# Altium project DAQ_REV_B.PrjPcb
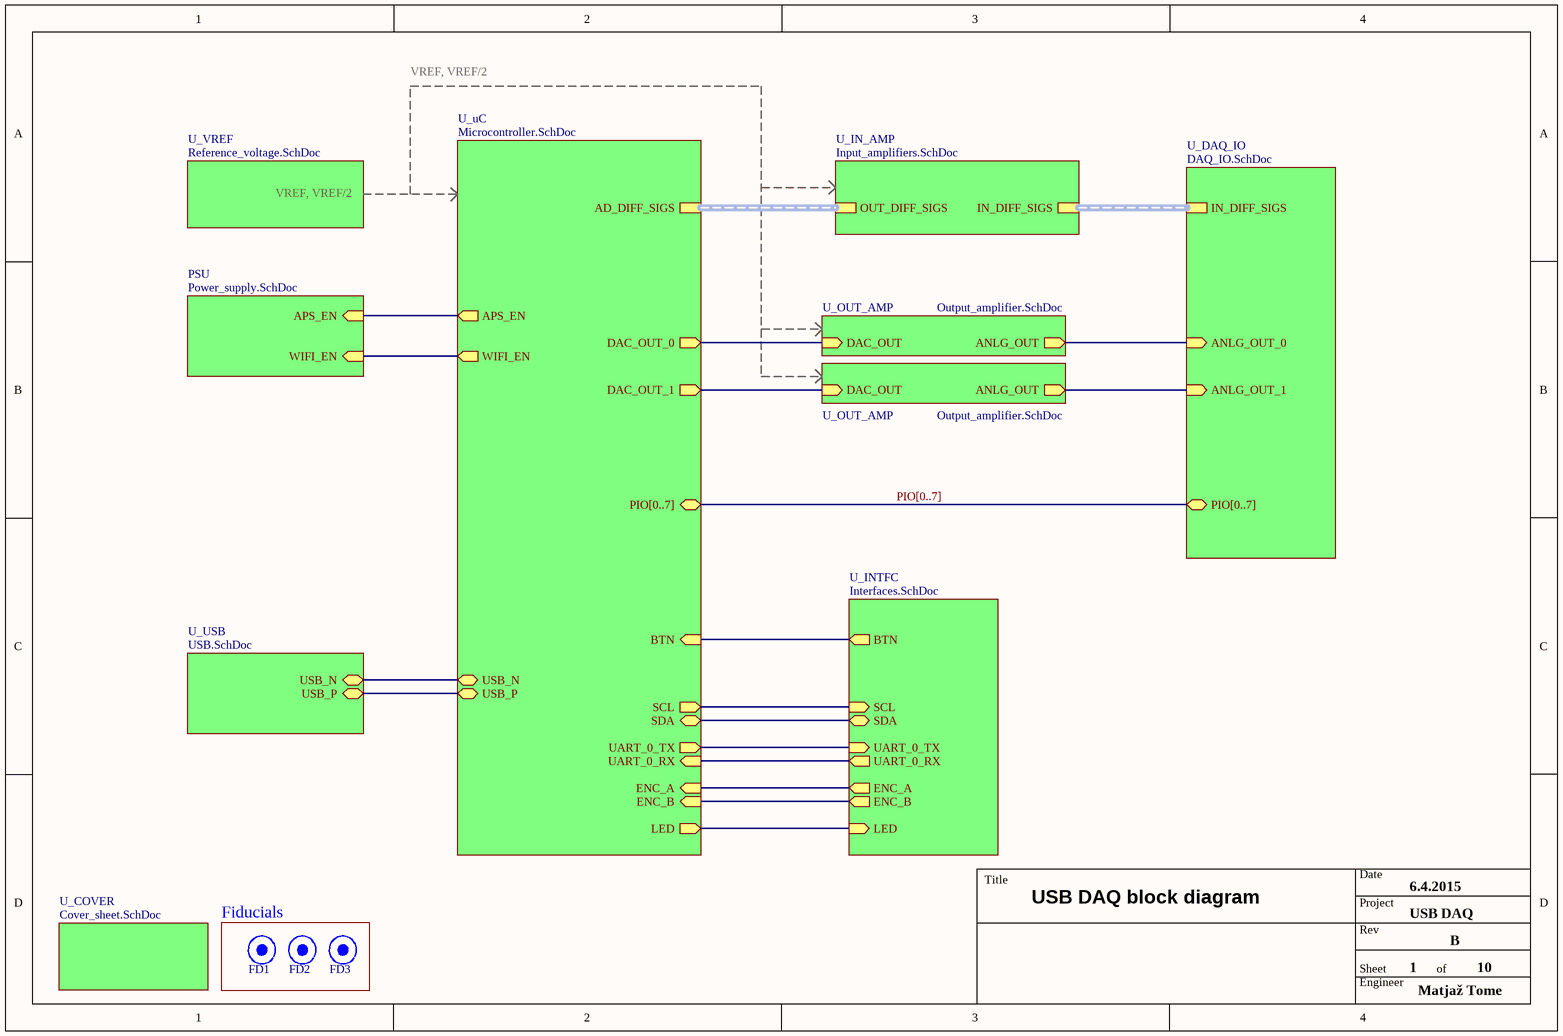
[diagram p0: DAQ_REV_B.SchDoc]
7 sheets, 113 parts. Net scope: hierarchical (ports join the sheet entries above them; power ports are global).
Board file: USB_DAQ.PcbDoc
Sheets:
  DAQ_REV_B.SchDoc
    U_uC = Microcontroller.SchDoc
    U_DAQ_IO = DAQ_IO.SchDoc
    U_INTFC = Interfaces.SchDoc
    U_IN_AMP = Input_amplifiers.SchDoc
    U_OUT_AMP = Output_amplifier.SchDoc
    U_VREF = Reference_voltage.SchDoc
    U_OUT_AMP = Output_amplifier.SchDoc

## Sheet DAQ_REV_B.SchDoc: USB DAQ block diagram
size A4; Date: 6.4.2015; Engineer: Matjaž Tome; DocumentNumber: 1; Revision: B; SheetNumber: 1; SheetTotal: 10; Project: USB DAQ

### Parts
FD1  Fiducial 1mm  [FID1]  (value not drawn)  (no BOM)
FD2  Fiducial 1mm  [FID1]  (value not drawn)  (no BOM)
FD3  Fiducial 1mm  [FID1]  (value not drawn)  (no BOM)

### Blocks framed on the sheet
Fiducials: FD1-FD3

### Sub-sheets
PSU = Power_supply.SchDoc (file not in this document): WIFI_EN (in), APS_EN (in)
U_COVER = Cover_sheet.SchDoc (file not in this document): no entries
U_DAQ_IO = DAQ_IO.SchDoc: ANLG_OUT_0 (in), ANLG_OUT_1 (in), IN_DIFF_SIGS (harness DIFF_SIGNALS), PIO[0..7] (bidir)
U_IN_AMP = Input_amplifiers.SchDoc: IN_DIFF_SIGS (harness DIFF_SIGNALS), OUT_DIFF_SIGS (harness DIFF_SIGNALS)
U_INTFC = Interfaces.SchDoc: BTN (out), SCL (in), SDA (bidir), UART_0_TX (in), UART_0_RX (out), ENC_A (out), ENC_B (out), LED (in)
U_OUT_AMP = Output_amplifier.SchDoc: ANLG_OUT (out), DAC_OUT (in)
U_OUT_AMP = Output_amplifier.SchDoc: ANLG_OUT (out), DAC_OUT (in)
U_uC = Microcontroller.SchDoc: USB_N (bidir), USB_P (bidir), DAC_OUT_0 (out), DAC_OUT_1 (out), APS_EN (out), UART_0_TX (out), UART_0_RX (in), SCL (out), SDA (bidir), ENC_A (in), ENC_B (in), WIFI_EN (out), BTN (in), LED (out), AD_DIFF_SIGS (harness DIFF_SIGNALS), PIO[0..7] (bidir)
U_USB = USB.SchDoc (file not in this document): USB_N (bidir), USB_P (bidir)
U_VREF = Reference_voltage.SchDoc: no entries

### Nets
ANLG_OUT: sheet U_DAQ_IO/ANLG_OUT_1, sheet U_OUT_AMP/ANLG_OUT
ANLG_OUT: sheet U_DAQ_IO/ANLG_OUT_0, sheet U_OUT_AMP/ANLG_OUT  [a separate net that carries the same name]
APS_EN: sheet U_uC/APS_EN, sheet PSU/APS_EN
BTN: sheet U_uC/BTN, sheet U_INTFC/BTN
DAC_OUT: sheet U_uC/DAC_OUT_0, sheet U_OUT_AMP/DAC_OUT
DAC_OUT: sheet U_uC/DAC_OUT_1, sheet U_OUT_AMP/DAC_OUT  [a separate net that carries the same name]
ENC_A: sheet U_uC/ENC_A, sheet U_INTFC/ENC_A
ENC_B: sheet U_uC/ENC_B, sheet U_INTFC/ENC_B
JTAG_TDO: sheet U_uC/LED, sheet U_INTFC/LED
SCL: sheet U_uC/SCL, sheet U_INTFC/SCL
SDA: sheet U_uC/SDA, sheet U_INTFC/SDA
UART_0_RX: sheet U_uC/UART_0_RX, sheet U_INTFC/UART_0_RX
UART_0_TX: sheet U_uC/UART_0_TX, sheet U_INTFC/UART_0_TX
USB_N: sheet U_uC/USB_N, sheet U_USB/USB_N
USB_P: sheet U_uC/USB_P, sheet U_USB/USB_P
WIFI_EN: sheet U_uC/WIFI_EN, sheet PSU/WIFI_EN

### Buses and harness runs
bus PIO[0..7] = sheet U_DAQ_IO/PIO[0..7] = sheet U_uC/PIO[0..7]
harness sheet U_DAQ_IO/IN_DIFF_SIGS = sheet U_IN_AMP/IN_DIFF_SIGS
harness sheet U_IN_AMP/OUT_DIFF_SIGS = sheet U_uC/AD_DIFF_SIGS

### Notes on the sheet
- VREF, VREF/2
- Title
- Date
- Project
- Rev
- Engineer
- Sheet
- of

### Library data of the parts
FD1-FD3 = FIDUCIAL: Part Number: XXC0016; Category: Fiducials

## Sheet Microcontroller.SchDoc: Microcontroller
size A4; Date: 6.4.2015; Engineer: Matjaž Tome; DocumentNumber: 4; Revision: B; SheetNumber: 2; SheetTotal: 10; Project: USB DAQ
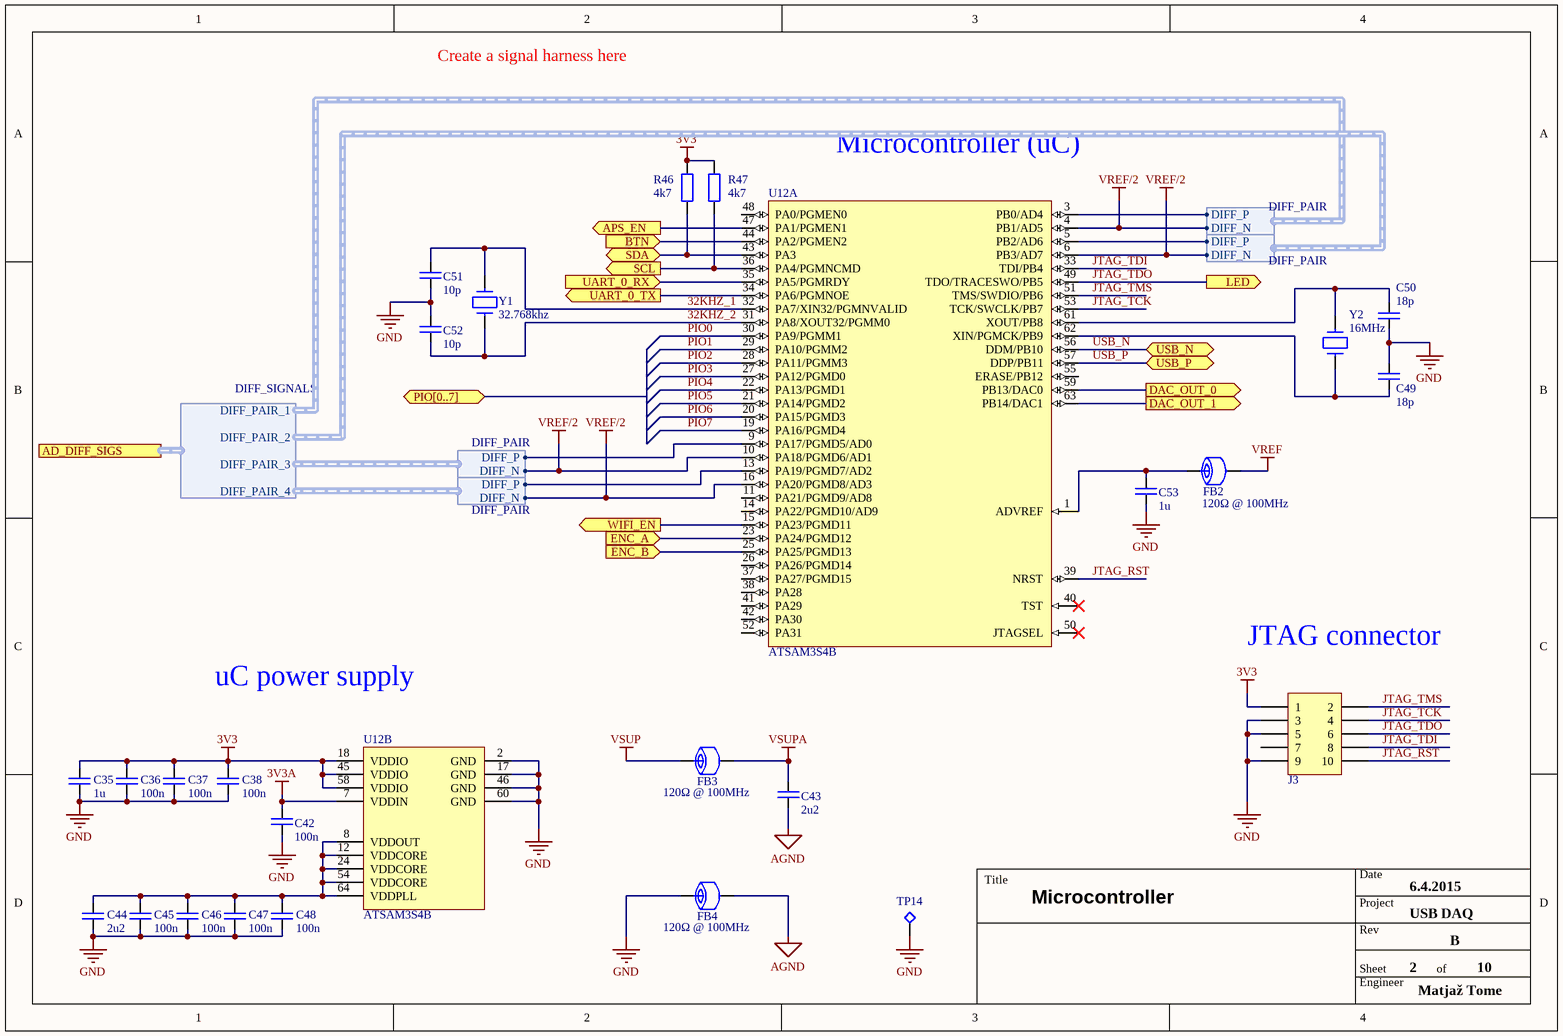
[diagram p1: Microcontroller.SchDoc]

### Parts
C35  1u  [C_0603]
C36  100n  [C_0603]
C37  100n  [C_0603]
C38  100n  [C_0603]
C42  100n  [C_0603]
C43  2u2  [C_0603]
C44  2u2  [C_0603]
C45  100n  [C_0603]
C46  100n  [C_0603]
C47  100n  [C_0603]
C48  100n  [C_0603]
C49  18p  [C_0603]
C50  18p  [C_0603]
C51  10p  [C_0603]
C52  10p  [C_0603]
C53  1u  [C_0603]
FB2  120Ω @ 100MHz  [SMD_0805]
FB3  120Ω @ 100MHz  [SMD_0805]
FB4  120Ω @ 100MHz  [SMD_0805]
J3  M50-3600542  [HEADER_2X05_1.27mm]  (value not drawn)
R46  4k7  [R_0603]
R47  4k7  [R_0603]
TP14  testpoint  [TP1_FULL]  (value not drawn)
U12  ATSAM3S4B  [LQFP64]  (parts A,B of 2)
Y1  32.768khz  [2X6_FLAT]
Y2  16MHz  [5X3.2]

### Ports
AD_DIFF_SIGS (harness DIFF_SIGNALS), APS_EN (out), BTN (in), DAC_OUT_0 (out), DAC_OUT_1 (out), ENC_A (in), ENC_B (in), LED (out), PIO[0..7] (bidir), SCL (out), SDA (bidir), UART_0_RX (in), UART_0_TX (out), USB_N (bidir), USB_P (bidir), WIFI_EN (out)

### Harnesses
DIFF_SIGNALS: DIFF_PAIR_1, DIFF_PAIR_2, DIFF_PAIR_3, DIFF_PAIR_4
DIFF_PAIR: DIFF_N, DIFF_P

### Nets
3V3: C35.1 C36.1 C37.1 C38.1 J3.1 R46.2 R47.2 U12.18(VDDIO) U12.45(VDDIO) U12.58(VDDIO)
3V3A: C42.1 U12.7(VDDIN)
AGND: C43.2 FB4.2
GND: C35.2 C36.2 C37.2 C38.2 C42.2 C44.2 C45.2 C46.2 C47.2 C48.2 C49.2 C50.2 C51.2 C52.2 C53.2 FB4.1 J3.3 J3.5 J3.9 TP14.1 U12.2(GND) U12.17(GND) U12.46(GND) U12.60(GND)
VREF: FB2.2
VREF/2: U12.4(PB1/AD5) U12.6(PB3/AD7) U12.10(PA18/PGMD6/AD1) U12.16(PA20/PGMD8/AD3) ; harness DIFF_PAIR.DIFF_N
VSUP: FB3.1
VSUPA: C43.1 FB3.2
32KHZ_1: C51.1 U12.32(PA7/XIN32/PGMNVALID) Y1.2
32KHZ_2: C52.1 U12.31(PA8/XOUT32/PGMM0) Y1.1
APS_EN: U12.47(PA1/PGMEN1) ; port APS_EN
BTN: U12.44(PA2/PGMEN2) ; port BTN
DAC_OUT: U12.59(PB13/DAC0) ; port DAC_OUT_0
DAC_OUT: U12.63(PB14/DAC1) ; port DAC_OUT_1  [a separate net that carries the same name]
ENC_A: U12.23(PA24/PGMD12) ; port ENC_A
ENC_B: U12.25(PA25/PGMD13) ; port ENC_B
JTAG_RST: J3.10 U12.39(NRST)
JTAG_TCK: J3.4 U12.53(TCK/SWCLK/PB7)
JTAG_TDI: J3.8 U12.33(TDI/PB4)
JTAG_TDO: J3.6 U12.49(TDO/TRACESWO/PB5) ; port LED
JTAG_TMS: J3.2 U12.51(TMS/SWDIO/PB6)
OUT1_P: U12.3(PB0/AD4) ; harness DIFF_PAIR.DIFF_P
OUT2_P: U12.5(PB2/AD6) ; harness DIFF_PAIR.DIFF_P
OUT3_P: U12.9(PA17/PGMD5/AD0) ; harness DIFF_PAIR.DIFF_P
OUT4_P: U12.13(PA19/PGMD7/AD2) ; harness DIFF_PAIR.DIFF_P
PIO0: U12.30(PA9/PGMM1)
PIO1: U12.29(PA10/PGMM2)
PIO2: U12.28(PA11/PGMM3)
PIO3: U12.27(PA12/PGMD0)
PIO4: U12.22(PA13/PGMD1)
PIO5: U12.21(PA14/PGMD2)
PIO6: U12.20(PA15/PGMD3)
PIO7: U12.19(PA16/PGMD4)
SCL: R47.1 U12.36(PA4/PGMNCMD) ; port SCL
SDA: R46.1 U12.43(PA3) ; port SDA
UART_0_RX: U12.35(PA5/PGMRDY) ; port UART_0_RX
UART_0_TX: U12.34(PA6/PGMNOE) ; port UART_0_TX
USB_N: U12.56(DDM/PB10) ; port USB_N
USB_P: U12.57(DDP/PB11) ; port USB_P
WIFI_EN: U12.15(PA23/PGMD11) ; port WIFI_EN
NetC44_1: C44.1 C45.1 C46.1 C47.1 C48.1 U12.8(VDDOUT) U12.12(VDDCORE) U12.24(VDDCORE) U12.54(VDDCORE) U12.64(VDDPLL)
NetC49_1: C49.1 U12.62(XIN/PGMCK/PB9) Y2.1
NetC50_1: C50.1 U12.61(XOUT/PB8) Y2.2
NetC53_1: C53.1 FB2.1 U12.1(ADVREF)

Not connected (* = marked no-connect by the designer): J3 7; U12 11(PA21/PGMD9/AD8) 14(PA22/PGMD10/AD9) 26(PA26/PGMD14) 37(PA27/PGMD15) 38(PA28) 40(TST)* 41(PA29) 42(PA30) 48(PA0/PGMEN0) 50(JTAGSEL)* 52(PA31) 55(ERASE/PB12)

### Notes on the sheet
- Create a signal harness here
- Microcontroller (uC)
- JTAG connector
- uC power supply
- Title
- Date
- Project
- Rev
- Engineer
- Sheet
- of

### Library data of the parts
C35-C38 C42-C53 = Capacitor: Generic capacitor
  C35 C53: Value: 1u
  C36-C38 C42 C45-C48: Value: 100n
  C43 C44: Value: 2u2
  C49 C50: Value: 18p
  C51 C52: Value: 10p
FB2-FB4 = BLM21AG121SN1D: Ferrite Bead, 0805 [2012 Metric], 120 ohm, 800 mA, BLM21A Series, 0.15 ohm, ± 25%; Manufacturer: Murata; Dealer number: 1515617; Dealer: Farnell; DC resistance: 0.15Ω; Max current: 0.2A; Category: ferite beads; Price: 0.082; Manufacturer Number: BLM21AG121SN1D; AC resistance: 120Ω; Frequency: 100MHz; Case: 0805; Technology: SMT; HelpURL: https://www.farnell.com/datasheets/1914683.pdf
J3 = M50-3600542: Pin Header, Board-to-Board, 1.27 mm, 2 Rows, 10 Contacts, Surface Mount, Archer M50 Series; Manufacturer: Harwin; Dealer number: 1022310; Dealer: Farnell; Gender: Male; Rows: 2; Pitch: 1.27mm; Category: Connectors; Price: 0.90; Manufacturer Number: M50-3600542; Pins: 5; Orientation: strait; Technology: SMD; HelpURL: https://cdn.harwin.com/pdfs/M50-360.pdf
R46 R47 = Resistor: Generic resistor; Value: 4k7
TP14 = Test Point: testpoint 1.5mm diameter no hole; Part Number: XXC0006; Category: testpoints
U12 = ATSAM3SXB: Cortex M3 ARM microcontroller; Part Number: XAM0003; Manufacturer: Atmel; Manufacturer Number: ATSAM3S4BA-AU; Dealer number: 1841656; Dealer: Farnell; Core: Cortex-M3; Supply voltage max: 3.6V; Supply voltage min: 1.62V; Flash: 256kB; RAM: 48kB; GPIOs: 47; Timers: 3; ADCs: 8; SPI: 1; IIC: 2; Max Frequency: 64MHz; Category: Integrated circuits; Price: 6.58; UART: 3; Case: LQFP64; Technology: SMT; HelpURL: https://www.farnell.com/datasheets/1698183.pdf; Temperature range: -40°C to +85°C
Y1 = R26-32.768- 12.5: Crystal, 32.768 kHz, Cylinder Radial, 6.2mm x 2mm Dia, 12.5 pF, 20 ppm, R26 Series; Part Number: XCR0010; Manufacturer: RALTRON; Dealer number: 1652573; Dealer: Farnell; Value: 32.758khz; Load capacitance: 12pF; Frequency tolerance: 20ppm; Category: Crystals; Price: 0.18; Manufacturer Number: R26-32.768- 12.5; Technology: THT; Case: 5X3.2_1; HelpURL: http://www.ramitechnology.com/products/spec/crystal/crystal-r38_26_145.pdf
Y2 = 7A-16.000MAAJ-T: Crystal, 16 MHz, SMD, 5mm x 3.2mm, 30 ppm, 18 pF, 30 ppm, 7A Series; Manufacturer: TCX; Dealer number: 1841946; Dealer: Farnell; Load capacitance: 18pF; Frequency tolerance: 30ppm; Category: Crystals; Price: 0.91; Manufacturer Number: 7A-16.000MAAJ-T; Value: 16MHz; Technology: SMT; Case: 5X3.2; HelpURL: https://www.farnell.com/datasheets/1041607.pdf

## Sheet DAQ_IO.SchDoc: DAQ I/O + protection
size A4; Date: 6.4.2015; Engineer: Matjaž Tome; DocumentNumber: 5; Revision: B; SheetNumber: 6; SheetTotal: 10; Project: USB DAQ
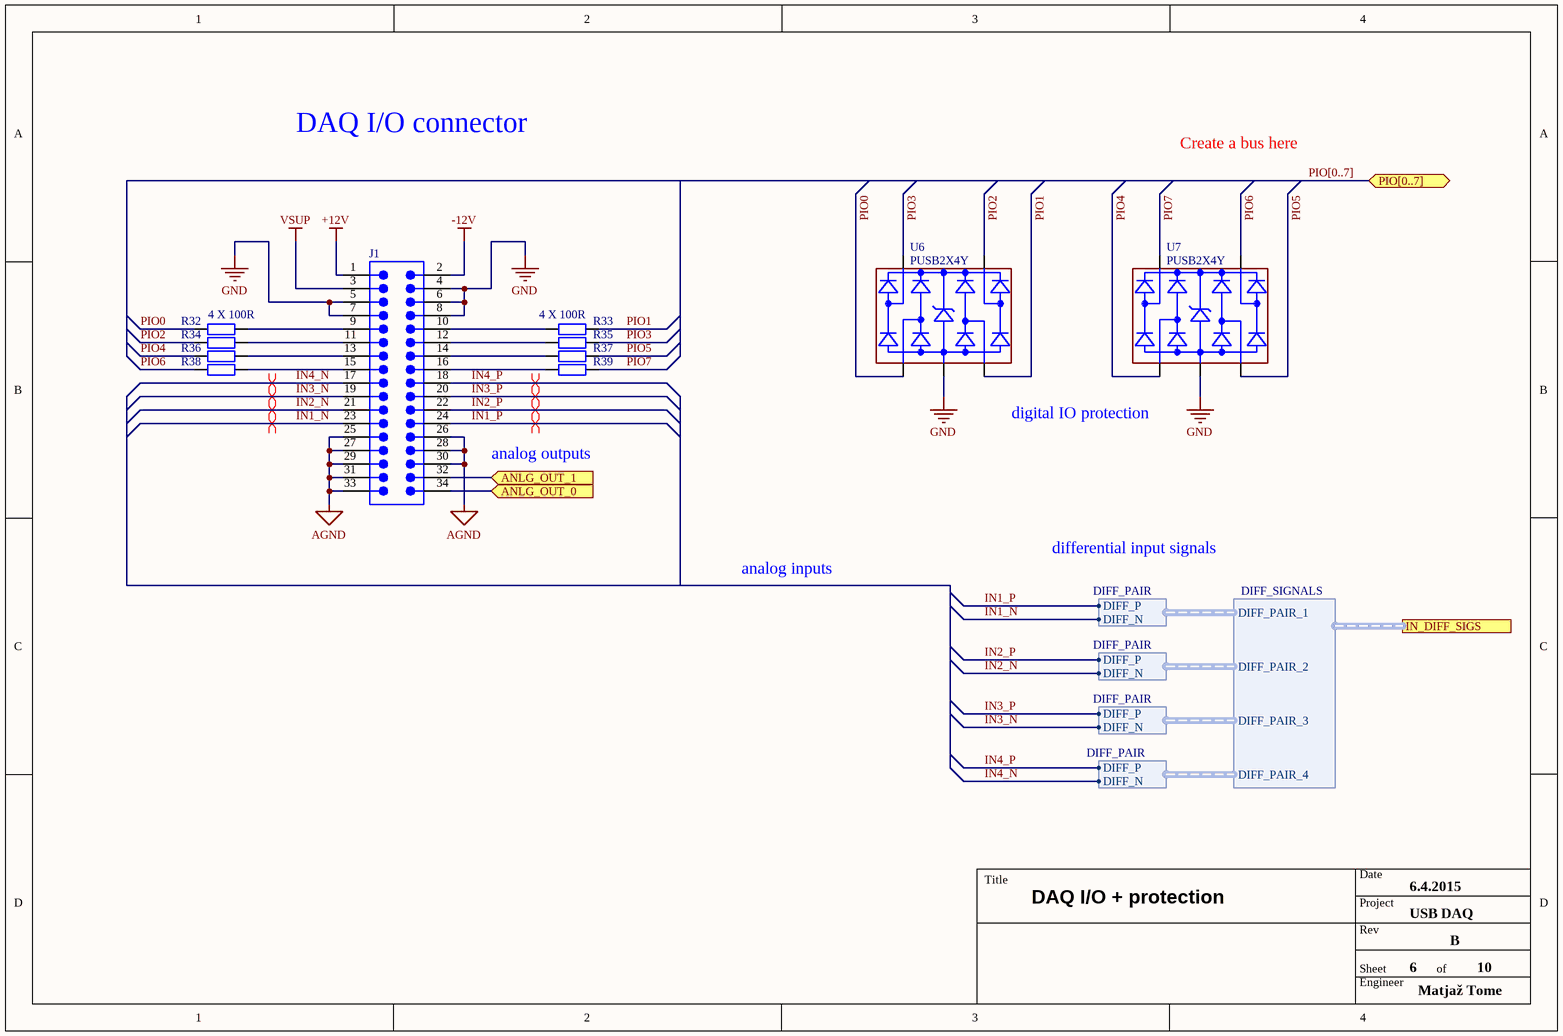
[diagram p2: DAQ_IO.SchDoc]

### Parts
J1  2X17  [IDC34R]  (value not drawn)
R32  100R  [R_0603]  (value not drawn)
R33  100R  [R_0603]  (value not drawn)
R34  100R  [R_0603]  (value not drawn)
R35  100R  [R_0603]  (value not drawn)
R36  100R  [R_0603]  (value not drawn)
R37  100R  [R_0603]  (value not drawn)
R38  100R  [R_0603]  (value not drawn)
R39  100R  [R_0603]  (value not drawn)
U6  PUSB2X4Y  [SOT363]
U7  PUSB2X4Y  [SOT363]

### Ports
ANLG_OUT_0 (in), ANLG_OUT_1 (in), IN_DIFF_SIGS (harness DIFF_SIGNALS), PIO[0..7] (bidir)

### Harnesses
DIFF_SIGNALS: DIFF_PAIR_1, DIFF_PAIR_2, DIFF_PAIR_3, DIFF_PAIR_4
DIFF_PAIR: DIFF_N, DIFF_P

### Nets
+12V: J1.1
-12V: J1.2
AGND: J1.25 J1.26 J1.27 J1.28 J1.29 J1.30 J1.31 J1.33
GND: J1.4 J1.5 J1.6 J1.7 J1.8 U6.2 U7.2
VSUP: J1.3
ANLG_OUT: J1.32 ; port ANLG_OUT_1
ANLG_OUT: J1.34 ; port ANLG_OUT_0  [a separate net that carries the same name]
IN1_N: J1.23 ; harness DIFF_PAIR.DIFF_N
IN1_P: J1.24 ; harness DIFF_PAIR.DIFF_P
IN2_N: J1.21 ; harness DIFF_PAIR.DIFF_N
IN2_P: J1.22 ; harness DIFF_PAIR.DIFF_P
IN3_N: J1.19 ; harness DIFF_PAIR.DIFF_N
IN3_P: J1.20 ; harness DIFF_PAIR.DIFF_P
IN4_N: J1.17 ; harness DIFF_PAIR.DIFF_N
IN4_P: J1.18 ; harness DIFF_PAIR.DIFF_P
PIO0: R32.1 U6.1
PIO1: R33.2 U6.3
PIO2: R34.1 U6.4
PIO3: R35.2 U6.6
PIO4: R36.1 U7.1
PIO5: R37.2 U7.3
PIO6: R38.1 U7.4
PIO7: R39.2 U7.6
NetJ1_9: J1.9 R32.2
NetJ1_10: J1.10 R33.1
NetJ1_11: J1.11 R34.2
NetJ1_12: J1.12 R35.1
NetJ1_13: J1.13 R36.2
NetJ1_14: J1.14 R37.1
NetJ1_15: J1.15 R38.2
NetJ1_16: J1.16 R39.1

### Buses and harness runs
bus PIO[0..7] = port PIO[0..7]

### Layout directives
differential pair: IN1_N, IN1_P, IN2_N, IN2_P, IN3_N, IN3_P, IN4_N, IN4_P

### Notes on the sheet
- DAQ I/O connector
- Create a bus here
- (near R32) 4 X 100R
- (near R33) 4 X 100R
- digital IO protection
- analog outputs
- analog inputs
- differential input signals
- Title
- Date
- Project
- Rev
- Engineer
- Sheet
- of

### Library data of the parts
J1 = 09 18 534 7323: Pin Header, Right Angle, Wire-to-Board, 2.54 mm, 2 Rows, 34 Contacts, Through Hole Right Angle; Manufacturer: Harting; Dealer number: 1106736; Dealer: Farnell; Pitch: 2.54mm; Lenght: 2.9mm; Strain Reliefe: no; Category: Connectors; Price: 2.26; Manufacturer Number: 09 18 534 7323; Pins: 34; Orientation: right angle; Technology: THT; HelpURL: https://www.farnell.com/datasheets/2012759.pdf
R32-R39 = Resistor: Generic resistor; Value: 100R
U6 U7 = PUSB2X4Y: ESD protection for high-speed interfaces; Part Number: XDE0000; Manufacturer: Multicomp; Dealer number: 2400968; Dealer: Farnell; Clamping voltage: 3.8V; Category: diode array; Price: 0.174; Manufacturer Number: PUSB2X4Y; Case: SOT363; Technology: SMT; HelpURL: https://www.farnell.com/datasheets/1801208.pdf

## Sheet Interfaces.SchDoc: Interfaces
size A4; Date: 6.4.2015; Engineer: Matjaž Tome; DocumentNumber: 7; Revision: B; SheetNumber: 5; SheetTotal: 10; Project: USB DAQ
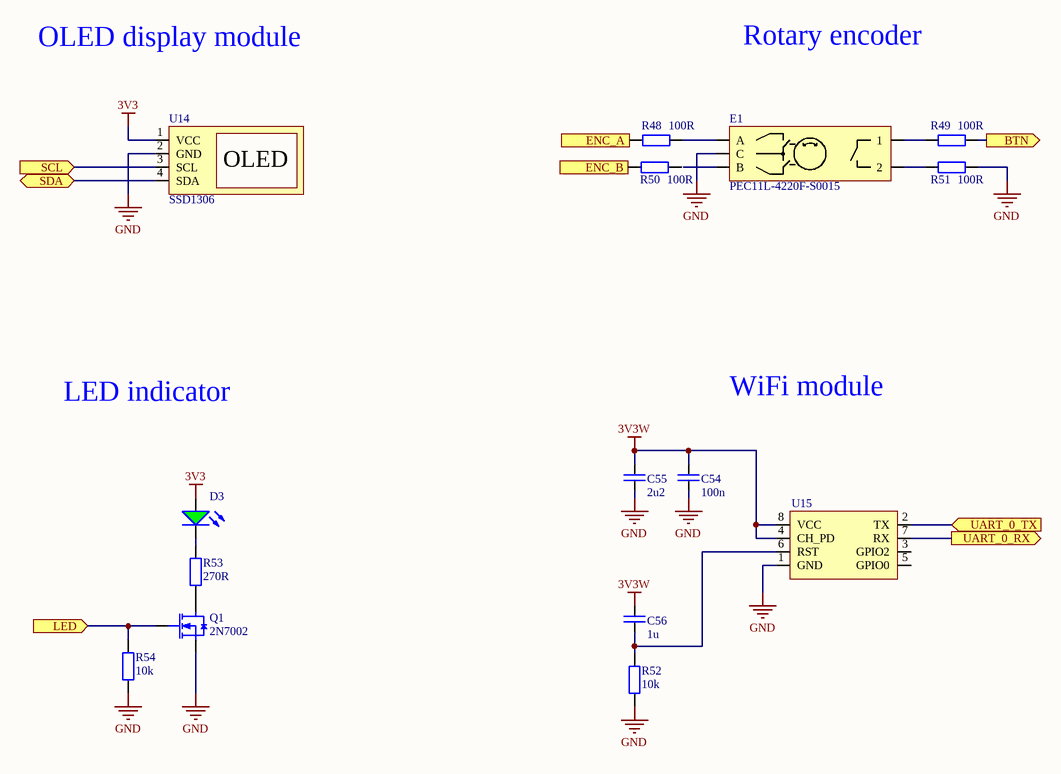
[diagram p3: Interfaces.SchDoc]

### Parts
C54  100n  [C_0603]
C55  2u2  [C_0603]
C56  1u  [C_0603]
D3  LED Green  [LED_0603]  (value not drawn)
E1  PEC11L-4220F-S0015  [PEC11L]
Q1  2N7002  [SOT23-3]
R48  100R  [R_0603]
R49  100R  [R_0603]
R50  100R  [R_0603]
R51  100R  [R_0603]
R52  10k  [R_0603]
R53  270R  [R_0603]
R54  10k  [R_0603]
U14  SSD1306  [OLED1]
U15  ESP-01  [ESP-01]  (value not drawn)

### Ports
BTN (out), ENC_A (out), ENC_B (out), LED (in), SCL (in), SDA (bidir), UART_0_RX (out), UART_0_TX (in)

### Nets
3V3: D3.2(+) U14.1(VCC)
3V3W: C54.2 C55.2 C56.2 U15.4(CH_PD) U15.8(VCC)
GND: C54.1 C55.1 E1.C Q1.2(S) R51.2 R52.1 R54.1 U14.2(GND) U15.1(GND)
BTN: R49.2 ; port BTN
ENC_A: R48.1 ; port ENC_A
ENC_B: R50.1 ; port ENC_B
JTAG_TDO: Q1.1(G) R54.2 ; port LED
SCL: U14.3(SCL) ; port SCL
SDA: U14.4(SDA) ; port SDA
UART_0_RX: U15.7(RX) ; port UART_0_RX
UART_0_TX: U15.2(TX) ; port UART_0_TX
NetC56_1: C56.1 R52.2 U15.6(RST)
NetD3_1: D3.1(-) R53.2
NetE1_1: E1.1 R49.1
NetE1_2: E1.2 R51.1
NetE1_A: E1.A R48.2
NetQ1_3: Q1.3(D) R53.1

Not connected (* = marked no-connect by the designer): E1 B; R50 2; U15 3(GPIO2) 5(GPIO0)

### Notes on the sheet
- Rotary encoder
- OLED display module
- LED indicator
- WiFi module
- Title
- Date
- Project
- Rev
- Engineer
- Sheet
- of
- (in symbol OLED_SSD1306) OLED

### Library data of the parts
C54-C56 = Capacitor: Generic capacitor
  C54: Value: 100n
  C55: Value: 2u2
  C56: Value: 1u
D3 = LED Green: Generic LED Green
E1 = PEC11L-4220F-S0015: Low Profile Encoder 15 PPR 2 Bit Quadrature 5VDC at 10 mA IP40 PCB Mount; Manufacturer: BOURNS; Dealer number: 652-PEC11L4220FS0015; Dealer: Mouser; Category: Rotary encoders; Price: 1.51; Technology: SMT; Manufacturer Number: PEC11L-4220F-S0015; HelpURL: https://www.farnell.com/datasheets/2259386.pdf
Q1 = 2N7002: 60V 0.3A N-channel MOSFET; Part Number: XMN0002; Manufacturer: NXP; Dealer number: 1510761; Dealer: Farnell; RDS: 2.8Ω; Max power disipation: 830mW; Type: N-enhancment mode; Logic level: Yes; Category: mosfets; Price: 0.039; Manufacturer Number: 2N7002; Max voltage: 60V; Max current: 0.3A; Case: SOT23-3; Technology: SMT; HelpURL: https://www.farnell.com/datasheets/1499179.pdf; SKU: 5000000000001
R48-R54 = Resistor: Generic resistor
  R48-R51: Value: 100R
  R52 R54: Value: 10k
  R53: Value: 270R
U14 = OLED_SSD1306: Oled display module; Part Number: OLM0000; Dealer: Ebay; Category: Displays; Price: 7; Technology: THT; HelpURL: https://cdn-shop.adafruit.com/datasheets/SSD1306.pdf
U15 = ESP-01: WIFI module; Part Number: XWM0000; Dealer: Ebay; Category: WIFI modules; Price: 3.8; Technology: THT; HelpURL: https://en.wikipedia.org/wiki/ESP8266

## Sheet Input_amplifiers.SchDoc: Input signal amplifiers
size A4; Engineer: Matjaž Tome; Revision: B; SheetNumber: 7; SheetTotal: 10
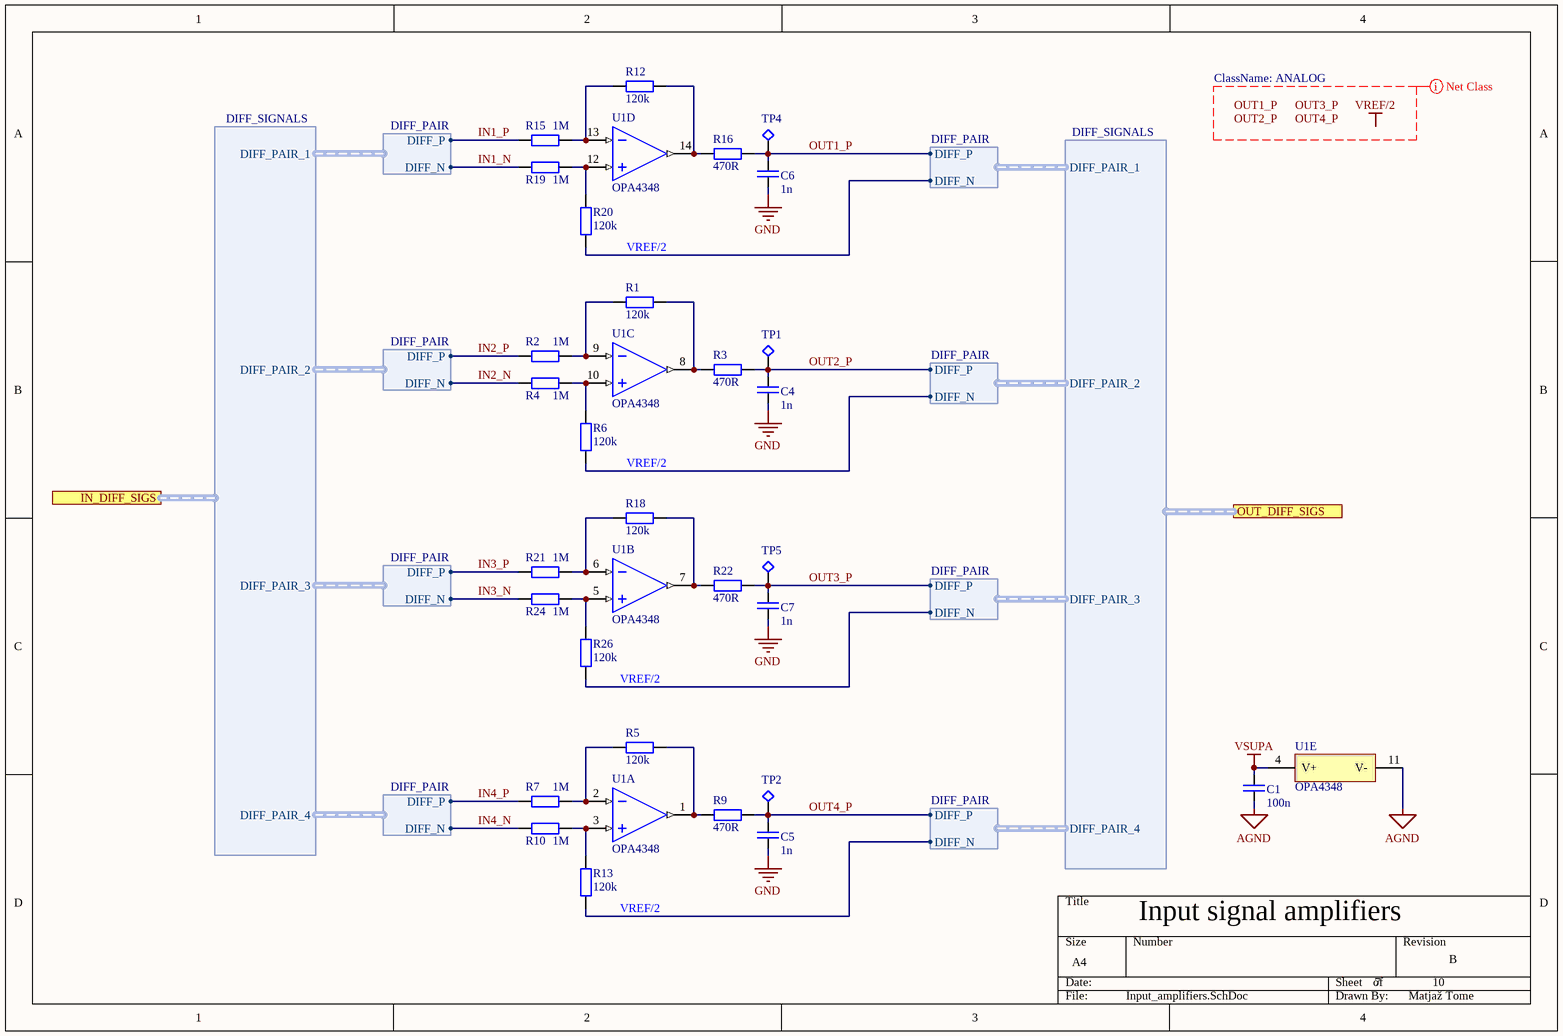
[diagram p4: Input_amplifiers.SchDoc]

### Parts
C1  100n  [C_0603]
C4  1n  [C_0603]
C5  1n  [C_0603]
C6  1n  [C_0603]
C7  1n  [C_0603]
R1  120k  [R_0603]
R2  1M  [R_0603]
R3  470R  [R_0603]
R4  1M  [R_0603]
R5  120k  [R_0603]
R6  120k  [R_0603]
R7  1M  [R_0603]
R9  470R  [R_0603]
R10  1M  [R_0603]
R12  120k  [R_0603]
R13  120k  [R_0603]
R15  1M  [R_0603]
R16  470R  [R_0603]
R18  120k  [R_0603]
R19  1M  [R_0603]
R20  120k  [R_0603]
R21  1M  [R_0603]
R22  470R  [R_0603]
R24  1M  [R_0603]
R26  120k  [R_0603]
TP1  testpoint  [TP1_FULL]  (value not drawn)
TP2  testpoint  [TP1_FULL]  (value not drawn)
TP4  testpoint  [TP1_FULL]  (value not drawn)
TP5  testpoint  [TP1_FULL]  (value not drawn)
U1  OPA4348  [SOIC14]  (parts A,B,C,D,E of 5)

### Ports
IN_DIFF_SIGS (harness DIFF_SIGNALS), OUT_DIFF_SIGS (harness DIFF_SIGNALS)

### Harnesses
DIFF_SIGNALS: DIFF_PAIR_1, DIFF_PAIR_2, DIFF_PAIR_3, DIFF_PAIR_4
DIFF_PAIR: DIFF_N, DIFF_P

### Nets
AGND: C1.1 U1.11(V-)
GND: C4.2 C5.2 C6.2 C7.2
VREF/2: R6.1 R13.1 R20.1 R26.1 ; harness DIFF_PAIR.DIFF_N
VSUPA: C1.2 U1.4(V+)
IN1_N: R19.1 ; harness DIFF_PAIR.DIFF_N
IN1_P: R15.1 ; harness DIFF_PAIR.DIFF_P
IN2_N: R4.1 ; harness DIFF_PAIR.DIFF_N
IN2_P: R2.1 ; harness DIFF_PAIR.DIFF_P
IN3_N: R24.1 ; harness DIFF_PAIR.DIFF_N
IN3_P: R21.1 ; harness DIFF_PAIR.DIFF_P
IN4_N: R10.1 ; harness DIFF_PAIR.DIFF_N
IN4_P: R7.1 ; harness DIFF_PAIR.DIFF_P
OUT1_P: C6.1 R16.2 TP4.1 ; harness DIFF_PAIR.DIFF_P
OUT2_P: C4.1 R3.2 TP1.1 ; harness DIFF_PAIR.DIFF_P
OUT3_P: C7.1 R22.2 TP5.1 ; harness DIFF_PAIR.DIFF_P
OUT4_P: C5.1 R9.2 TP2.1 ; harness DIFF_PAIR.DIFF_P
NetR1_1: R1.1 R2.2 U1.9(-IN_C)
NetR1_2: R1.2 R3.1 U1.8(OUT_C)
NetR4_2: R4.2 R6.2 U1.10(+IN_C)
NetR5_1: R5.1 R7.2 U1.2(-IN_A)
NetR5_2: R5.2 R9.1 U1.1(OUT_A)
NetR10_2: R10.2 R13.2 U1.3(+IN_A)
NetR12_1: R12.1 R15.2 U1.13(-IN_D)
NetR12_2: R12.2 R16.1 U1.14(OUT_D)
NetR18_1: R18.1 R21.2 U1.6(-IN_B)
NetR18_2: R18.2 R22.1 U1.7(OUT_B)
NetR19_2: R19.2 R20.2 U1.12(+IN_D)
NetR24_2: R24.2 R26.2 U1.5(+IN_B)

### Layout directives
net class ANALOG: OUT1_P, OUT2_P, OUT3_P, OUT4_P, VREF/2

### Notes on the sheet
- VREF/2
- (near R26) VREF/2
- (near R13) VREF/2
- Labels drawn without touching a wire or pin: OUT1_P, OUT2_P, OUT3_P, OUT4_P, VREF/2

### Library data of the parts
C1 C4-C7 = Capacitor: Generic capacitor
  C1: Value: 100n
  C4-C7: Value: 1n
R1-R7 R9 R10 R12 R13 R15 R16 R18-R22 R24 R26 = Resistor: Generic resistor
  R1 R5 R6 R12 R13 R18 R20 R26: Value: 120k
  R2 R4 R7 R10 R15 R19 R21 R24: Value: 1M
  R3 R9 R16 R22: Value: 470R
TP1 TP2 TP4 TP5 = Test Point: as TP14 on sheet Microcontroller; Category: testpoints
U1 = OPA4348: Operational Amplifiers - Op Amps 1MHz 45uA RRIO Quad Op Amp; Manufacturer: Texas Instruments; Manufacturer Number: OPA4348AID; Dealer number: 595-OPA4348AID; Dealer: Mouser; Supply voltage max: 5.5V; Supply voltage min: 2.1V; Devices: 4; Rail to Rail: IN/OUT; Category: Integrated circuits; Price: 1.64; GBP: 1MHz; Case: SOIC14; Technology: SMT; HelpURL: http://www.ti.com/general/docs/suppproductinfo.tsp?distId=26&gotoUrl=http%3A%2F%2Fwww.ti.com%2Flit%2Fgpn%2Fopa4348

## Sheet Output_amplifier.SchDoc: DAC output amplifier
size A4; Engineer: Matjaž Tome; Revision: B; SheetNumber: 8; SheetTotal: 10
Used 2 times, as channels U_OUT_AMP, U_OUT_AMP. Parts and nets are listed once, with the designators drawn on the sheet.
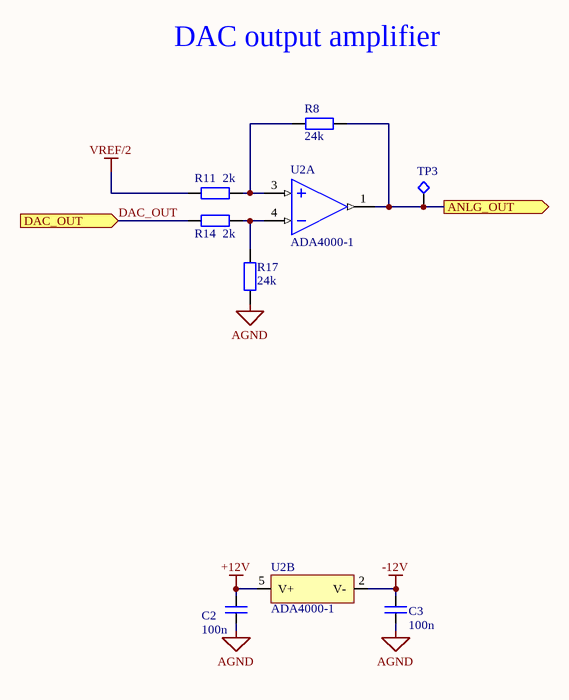
[diagram p5: Output_amplifier.SchDoc]

### Parts
C2  100n  [C_0603]
C3  100n  [C_0603]
R8  24k  [R_0603]
R11  2k  [R_0603]
R14  2k  [R_0603]
R17  24k  [R_0603]
TP3  testpoint  [TP1_FULL]  (value not drawn)
U2  ADA4000-1  [SOT23-5]  (parts A,B of 2)

### Ports
ANLG_OUT (out), DAC_OUT (in)

### Nets
+12V: C2.1 U2.5(V+)
-12V: C3.1 U2.2(V-)
AGND: C2.2 C3.2 R17.1
VREF/2: R11.1
ANLG_OUT: R8.2 TP3.1 U2.1(OUT) ; port ANLG_OUT
DAC_OUT: R14.1 ; port DAC_OUT
NetR8_1: R8.1 R11.2 U2.3(IN+)
NetR14_2: R14.2 R17.2 U2.4(IN-)

### Channels
U_OUT_AMP: designators end in _U_OUT_AMP#1; ports ANLG_OUT=ANLG_OUT DAC_OUT=DAC_OUT
U_OUT_AMP: designators end in _U_OUT_AMP#2; ports ANLG_OUT=ANLG_OUT DAC_OUT=DAC_OUT

### Notes on the sheet
- DAC output amplifier

### Library data of the parts
C2 C3 = Capacitor: Generic capacitor; Value: 100n
R8 R11 R14 R17 = Resistor: Generic resistor
  R8 R17: Value: 24k
  R11 R14: Value: 2k
TP3 = Test Point: as TP14 on sheet Microcontroller; Category: testpoints
U2 = ADA4000-1: Operational Amplifier, Single, 1 Amplifier, 5 MHz, 20 V/µs, ± 4V to ± 18V, TSOT, 5 Pins; Part Number: XOG0003; Manufacturer: Analog devices; Manufacturer Number: ADA4000-1AUJZ-R7; Dealer number: 2461002; Dealer: Farnell; Supply voltage max: +-18V; Devices: 1; Category: Integrated circuits; Price: 1.97; Case: SOT; Technology: SMT; HelpURL: https://www.farnell.com/datasheets/698265.pdf

## Sheet Reference_voltage.SchDoc: Reference voltage
size A4; Engineer: Matjaž Tome; Revision: B; SheetNumber: 9; SheetTotal: 10
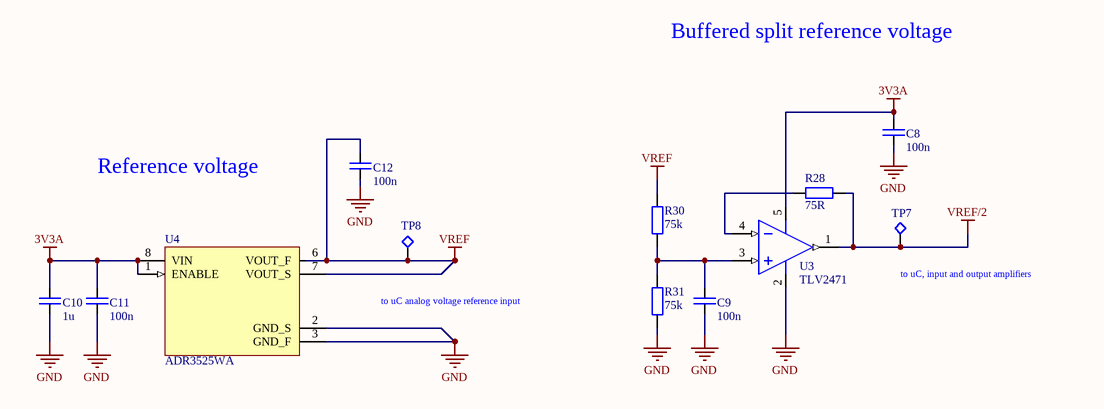
[diagram p6: Reference_voltage.SchDoc]

### Parts
C8  100n  [C_0603]
C9  100n  [C_0603]
C10  1u  [C_0603]
C11  100n  [C_0603]
C12  100n  [C_0603]
R28  75R  [R_0603]
R30  75k  [R_0603]
R31  75k  [R_0603]
TP7  testpoint  [TP1_FULL]  (value not drawn)
TP8  testpoint  [TP1_FULL]  (value not drawn)
U3  TLV2471  [SOT23-5]
U4  ADR3525WA  [MSOP8]

### Nets
3V3A: C8.2 C10.1 C11.1 U3.5(V+) U4.1(ENABLE) U4.8(VIN)
GND: C8.1 C9.2 C10.2 C11.2 C12.2 R31.1 U3.2(V-) U4.2(GND_S) U4.3(GND_F)
VREF: C12.1 R30.2 TP8.1 U4.6(VOUT_F) U4.7(VOUT_S)
VREF/2: R28.2 TP7.1 U3.1(OUT_A)
NetC9_1: C9.1 R30.1 R31.2 U3.3(+IN_A)
NetR28_1: R28.1 U3.4(-IN_A)

### Notes on the sheet
- Buffered split reference voltage
- Reference voltage
- (near TP7) to uC, input and output amplifiers
- (near TP8) to uC analog voltage reference input

### Library data of the parts
C8-C12 = Capacitor: Generic capacitor
  C8 C9 C11 C12: Value: 100n
  C10: Value: 1u
R28 R30 R31 = Resistor: Generic resistor
  R28: Value: 75R
  R30 R31: Value: 75k
TP7 TP8 = Test Point: as TP14 on sheet Microcontroller; Category: testpoints
U3 = TLV2471: FAMILY OF 600μA/Ch 2.8MHz RAIL-TO-RAIL INPUT/OUTPUT / HIGH-DRIVE OPERATIONAL AMPLIFIERS WITH SHUTDOWN; Part Number: XOG0002; Manufacturer: Texas Instruments; Manufacturer Number: TLV2471IDBVT; Dealer number: 1102964; Dealer: Farnell; Supply voltage max: 6V; Supply voltage min: 2.7V; Devices: 1; Rail to Rail: IN/OUT; Category: Integrated circuits; Price: 1.43; GBP: 2.8MHz; Case: SOT23-5; Technology: SMT; HelpURL: http://www.ti.com/general/docs/suppproductinfo.tsp?distId=26&gotoUrl=http%3A%2F%2Fwww.ti.com%2Flit%2Fgpn%2Ftlv2471
U4 = ADR3525W: Micropower, High Accuracy / Voltage References; Part Number: VRX0002; Manufacturer: Analog devices; Manufacturer Number: ADR3525WARMZ-R7; Dealer number: 2077701; Dealer: Farnell; Output Voltage: 2.5V; Max input voltage: 5.5V; Output current: 10mA; Voltage tolerance: 0.1%; Category: Integrated circuits; Price: 1.66; Case: MSOP8; Technology: SMT; HelpURL: https://www.farnell.com/datasheets/1511785.pdf

## Nets that join several sheets
3V3: Microcontroller (10 pins), Interfaces (D3.2 U14.1)
3V3A: Microcontroller (C42.1 U12.7), Reference_voltage (6 pins)
+12V: DAQ_IO (J1.1), U_OUT_AMP (C2_U_OUT_AMP#1.1 U2_U_OUT_AMP#1.5), U_OUT_AMP (C2_U_OUT_AMP#2.1 U2_U_OUT_AMP#2.5)
-12V: DAQ_IO (J1.2), U_OUT_AMP (C3_U_OUT_AMP#1.1 U2_U_OUT_AMP#1.2), U_OUT_AMP (C3_U_OUT_AMP#2.1 U2_U_OUT_AMP#2.2)
AGND: Microcontroller (C43.2 FB4.2), DAQ_IO (8 pins), Input_amplifiers (C1.1 U1.11), U_OUT_AMP (C2_U_OUT_AMP#1.2 C3_U_OUT_AMP#1.2 R17_U_OUT_AMP#1.1), U_OUT_AMP (C2_U_OUT_AMP#2.2 C3_U_OUT_AMP#2.2 R17_U_OUT_AMP#2.1)
GND: Microcontroller (24 pins), DAQ_IO (7 pins), Interfaces (9 pins), Input_amplifiers (C4.2 C5.2 C6.2 C7.2), Reference_voltage (9 pins)
VREF: Microcontroller (FB2.2), Reference_voltage (5 pins)
VREF/2: Microcontroller (U12.4 U12.6 U12.10 U12.16), Input_amplifiers (R6.1 R13.1 R20.1 R26.1), U_OUT_AMP (R11_U_OUT_AMP#1.1), Reference_voltage (R28.2 TP7.1 U3.1), U_OUT_AMP (R11_U_OUT_AMP#2.1)
VSUP: Microcontroller (FB3.1), DAQ_IO (J1.3)
VSUPA: Microcontroller (C43.1 FB3.2), Input_amplifiers (C1.2 U1.4)
ANLG_OUT: DAQ_IO (J1.32), U_OUT_AMP (R8_U_OUT_AMP#2.2 TP3_U_OUT_AMP#2.1 U2_U_OUT_AMP#2.1)
ANLG_OUT: DAQ_IO (J1.34), U_OUT_AMP (R8_U_OUT_AMP#1.2 TP3_U_OUT_AMP#1.1 U2_U_OUT_AMP#1.1)
BTN: Microcontroller (U12.44), Interfaces (R49.2)
DAC_OUT: Microcontroller (U12.59), U_OUT_AMP (R14_U_OUT_AMP#1.1)
DAC_OUT: Microcontroller (U12.63), U_OUT_AMP (R14_U_OUT_AMP#2.1)
ENC_A: Microcontroller (U12.23), Interfaces (R48.1)
ENC_B: Microcontroller (U12.25), Interfaces (R50.1)
IN1_N: DAQ_IO (J1.23), Input_amplifiers (R19.1)
IN1_P: DAQ_IO (J1.24), Input_amplifiers (R15.1)
IN2_N: DAQ_IO (J1.21), Input_amplifiers (R4.1)
IN2_P: DAQ_IO (J1.22), Input_amplifiers (R2.1)
IN3_N: DAQ_IO (J1.19), Input_amplifiers (R24.1)
IN3_P: DAQ_IO (J1.20), Input_amplifiers (R21.1)
IN4_N: DAQ_IO (J1.17), Input_amplifiers (R10.1)
IN4_P: DAQ_IO (J1.18), Input_amplifiers (R7.1)
JTAG_TDO: Microcontroller (J3.6 U12.49), Interfaces (Q1.1 R54.2)
OUT1_P: Microcontroller (U12.3), Input_amplifiers (C6.1 R16.2 TP4.1)
OUT2_P: Microcontroller (U12.5), Input_amplifiers (C4.1 R3.2 TP1.1)
OUT3_P: Microcontroller (U12.9), Input_amplifiers (C7.1 R22.2 TP5.1)
OUT4_P: Microcontroller (U12.13), Input_amplifiers (C5.1 R9.2 TP2.1)
SCL: Microcontroller (R47.1 U12.36), Interfaces (U14.3)
SDA: Microcontroller (R46.1 U12.43), Interfaces (U14.4)
UART_0_RX: Microcontroller (U12.35), Interfaces (U15.7)
UART_0_TX: Microcontroller (U12.34), Interfaces (U15.2)